# EAGLE design SOIL_WATER (EAGLE 9.6.2)
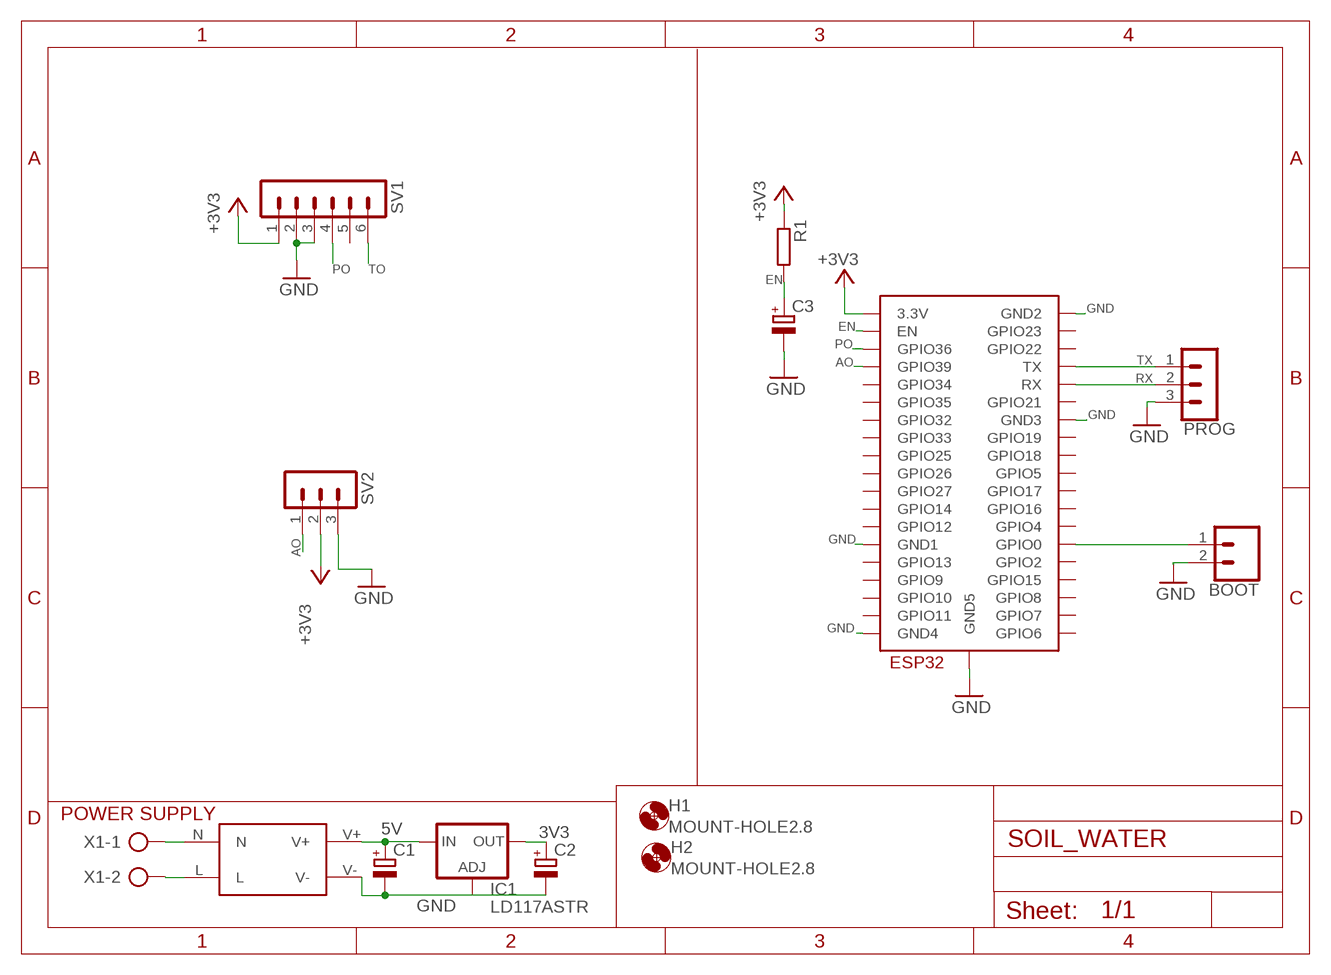
[diagram p0: schematic, sheet 1]

## Parts
BOOT  CONN_02  [1X02]
C1  CPOL-EUE1.8-4  [E1,8-4]
C2  CPOL-EUE1.8-4  [E1,8-4]
C3  CPOL-EUE1.8-4  [E1,8-4]
H1  MOUNT-HOLE2.8  [2,8]
H2  MOUNT-HOLE2.8  [2,8]
IC1  LD117ASTR  [SOT223]
PROG  MA03-1  [MA03-1]
R1  R-EU_0204/7  [0204/7]
SV1  MA06-1  [MA06-1]
SV2  MA03-1  [MA03-1]
U$1  ESP32-WROOM  [ESP32-WROOM]
U$2  HLK-PM01  [HLK-PM01-PAK]
X1  AK500/2  [AK500/2]

## Nets
3V3: C2.+ IC1.4(OUT)
5V: C1.+ IC1.3(IN) U$2.V+
+3V3: R1.1 SV1.1 SV2.2 U$1.3V3(3.3V)
AO: SV2.1 U$1.SENSOR_VN(GPIO39)
EN: C3.+ R1.2 U$1.EN
GND: BOOT.2 C1.- C2.- C3.- IC1.1(ADJ) PROG.3 SV1.2 SV1.3 SV2.3 U$1.GND1 U$1.GND2 U$1.GND3 U$1.GND4 U$1.GND5 U$2.V-
N$1: U$2.N X1.1
N$2: U$2.L X1.2
N$3: BOOT.1 U$1.IO0(GPIO0)
PO: SV1.4 U$1.SENSOR_VP(GPIO36)
RX: PROG.2 U$1.RX
TO: SV1.6
TX: PROG.1 U$1.TX
Unconnected: SV1.5 U$1.CLK(GPIO6) U$1.CMD(GPIO11) U$1.IO2(GPIO2) U$1.IO4(GPIO4) U$1.IO5(GPIO5) U$1.IO12(GPIO12) U$1.IO13(GPIO13) U$1.IO14(GPIO14) U$1.IO15(GPIO15) U$1.IO16(GPIO16) U$1.IO17(GPIO17) U$1.IO18(GPIO18) U$1.IO19(GPIO19) U$1.IO21(GPIO21) U$1.IO22(GPIO22) U$1.IO23(GPIO23) U$1.IO25(GPIO25) U$1.IO26(GPIO26) U$1.IO27(GPIO27) U$1.IO32(GPIO32) U$1.IO33(GPIO33) U$1.IO34(GPIO34) U$1.IO35(GPIO35) U$1.SD0(GPIO7) U$1.SD1(GPIO8) U$1.SD2(GPIO9) U$1.SD3(GPIO10)

## Notes on the sheet
- POWER SUPPLY

## Library data of the parts
BOOT = SparkFun-Connectors:CONN_02: Multi connection point. Often used as Generic Header-pin footprint for 0.1 inch spaced/style header connections On any of the 0.1 inch spaced packages, you can populate with these: Break Away Headers - Straight <https://www.sparkfun.com/products/116> (PRT-00116) Break Away Male Headers - Right Angle <https://www.sparkfun.com/products/553> (PRT-00553) Female Headers <https://www.sparkfun.com/products/115> (PRT-00115) Break Away Headers - Machine Pin <https://www.sparkfun.com/products/117> (PRT-00117) Break Away Female Headers - Swiss Machine Pin <https://www.sparkfun.com/products/743> (PRT-00743) For SCREWTERMINALS and SPRING TERMINALS visit here: Screw Terimnals on SparkFun.com <https://www.sparkfun.com/search/results?term=Screw+Terminals> (5mm/3.5mm/2.54mm spacing) This device is also useful as a general connection point to wire up your design to another part of your project. Our various solder wires solder well into these plated through hole pads. Hook-Up Wire - Assortment (Stranded, 22 AWG) <https://www.sparkfun.com/products/11375> (PRT-11375) Hook-Up Wire - Assortment (Solid Core, 22 AWG) <https://www.sparkfun.com/products/11367> (PRT-11367) View the entire wire category on our website here <https://www.sparkfun.com/categories/141> Special notes: Molex polarized connector foot print use with: PRT-08233 with associated crimp pins and housings. 2.54_SCREWTERM for use with PRT-10571. 3.5mm Screw Terminal footprints for PRT-08084 5mm Screw Terminal footprints for use with PRT-08432
C1-C3 = resistor:CPOL-EU: POLARIZED CAPACITOR, European symbol
H1 H2 = holes:MOUNT-HOLE: MOUNTING HOLE with drill center marker
IC1 = v-reg:LD117A?*: Low drop fixed and adjustable positive voltage regulators 1 A Source: http://www.st.com/stonline/products/literature/ds/7194/ld1117axx.pdf
PROG SV2 = con-lstb:MA03-1: PIN HEADER; OC_FARNELL: unknown; OC_NEWARK: unknown
R1 = resistor:R-EU_: RESISTOR, European symbol
SV1 = con-lstb:MA06-1: PIN HEADER; OC_FARNELL: unknown; OC_NEWARK: unknown
U$1 = ESP32:ESP32-WROOM
U$2 = HLK-PM01:HLK-PM01: Check prices <https://pricing.snapeda.com/parts/hlk-pm01/Hi-link/view-part?ref=eda>; AVAILABILITY: No availability data; DESCRIPTION: The 3W ultra-small series module power supply is a small-volume, high-efficiency AC DC power module supply designed by Shenzhen Hi-Link Electronics Co.,Ltd. It has the advantages of global input voltage range, low temperature rise, low power consumption,high efficiency, high reliability and high safety isolation. It has been widely used in smart home, automation control, communications equipment, instrumentation and other industries.; MF: Hi-link; MP: hlk-pm01; PACKAGE: Package; PRICE: None
X1 = con-ptr500:AK500/2: CONNECTOR; OC_FARNELL: unknown; OC_NEWARK: unknown

## Board
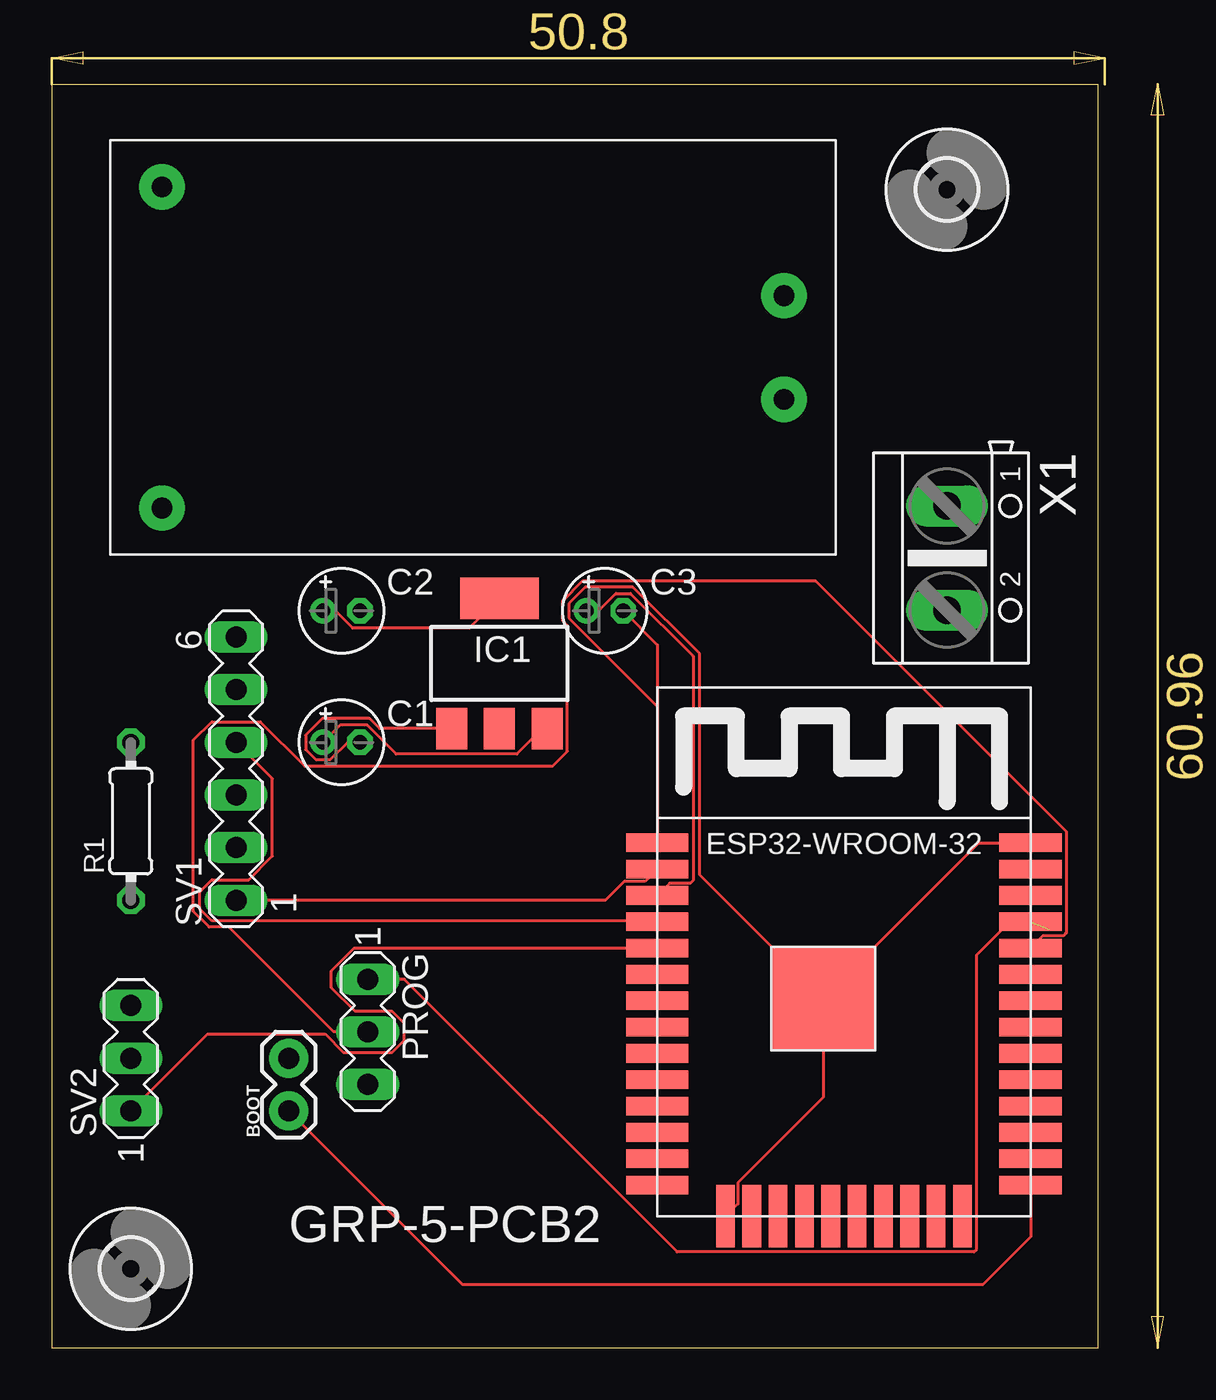
[diagram p1: board, top side]
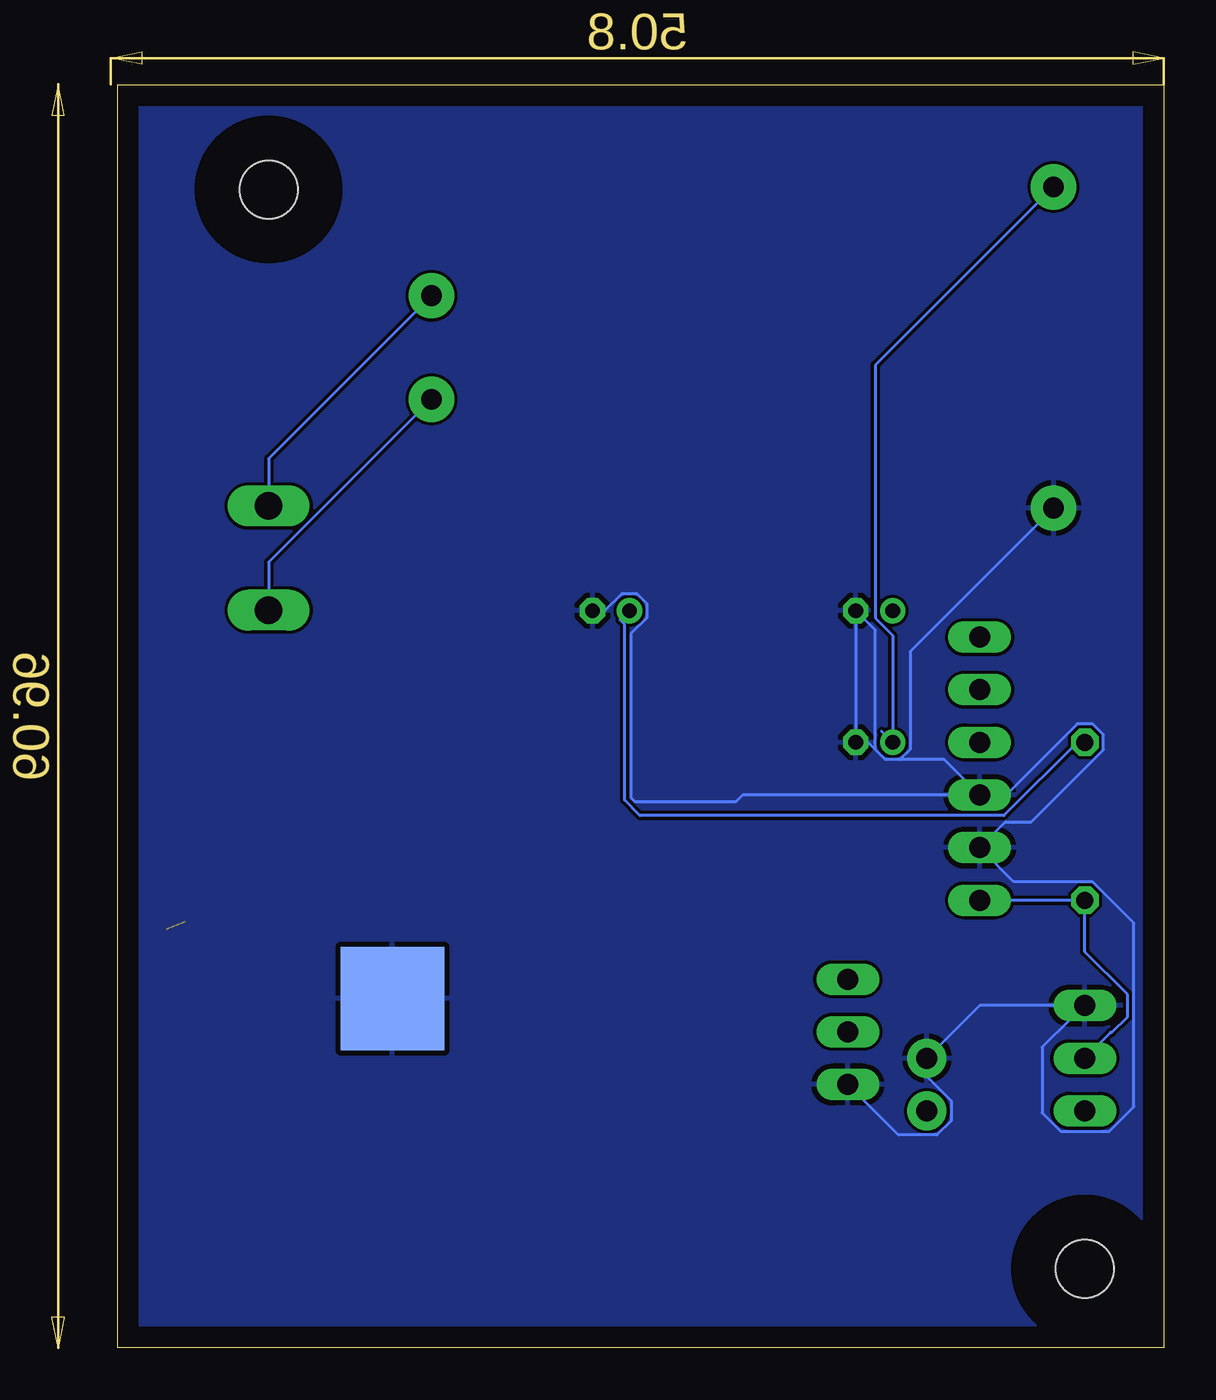
[diagram p2: board, bottom side, seen from below]

Size 50.47 x 60.95 mm. Coordinates in mm from the lower left corner, seen from the top.
Outline: 0,0 50.47,0 50.47,60.95 0,60.95 0,0
Copper layers (1*16): Top 0.035mm / dielectric 1.5mm / Bottom 0.035mm
Design rules "default": minimum track width 6mil, minimum drill 0.35mm, track to track 6mil, track to pad 6mil, pad to pad 6mil, via to via 6mil, smd to smd 6mil, copper to edge 40mil, drill to drill 6mil, minimum pad ring 10mil, minimum via ring 8mil, stop-mask expansion 4mil, vias tented up to drill 0mil, thermal gap 10mil

### Footprints (pad centres in the part's own frame; a part is rotated, then mirrored left to right if it is on the bottom)
1X02 = drill 1.016 pad 1.88: 1 0,0; 2 2.54,0
E1,8-4 = drill 0.711 pad 1.168: + -0.889,0 | drill 0.711 pad 1.168 octagon: - 0.889,0
2,8 = hole 2.8: 0,0
SOT223 = smd 1.5 x 2: 1 -2.3,-3.15; 2 0,-3.15; 3 2.3,-3.15 | smd 3.8 x 2: 4 0,3.15
MA03-1 = drill 1.016 long: 1 -2.54,0; 2 0,0; 3 2.54,0
0204/7 = drill 0.813 octagon: 1 -3.81,0; 2 3.81,0
MA06-1 = drill 1.016 long: 1 -6.35,0; 2 -3.81,0; 3 -1.27,0; 4 1.27,0; 5 3.81,0; 6 6.35,0
ESP32-WROOM = smd 3 x 0.9: 3V3 0,16.74; EN 0,15.47; GND1 0,18.01; GND3 18,18.01; IO0 18,1.5; IO4 18,2.77; IO5 18,6.58; IO12 0,1.5; IO14 0,2.77; IO16 18,4.04; IO17 18,5.31; IO18 18,7.85; IO19 18,9.12; IO21 18,11.66; IO22 18,15.47; IO23 18,16.74; IO25 0,6.58; IO26 0,5.31; IO27 0,4.04; IO32 0,9.12; IO33 0,7.85; IO34 0,11.66; IO35 0,10.39; NC 18,10.39; RX 18,12.93; SENSOR_VN 0,12.93; SENSOR_VP 0,14.2; TX 18,14.2 | smd 0.9 x 3: CLK 9.635,0; CMD 8.365,0; GND2 3.285,0; IO2 14.715,0; IO13 4.555,0; IO15 13.445,0; SD0 10.905,0; SD1 12.175,0; SD2 5.825,0; SD3 7.095,0 | smd 5 x 5: GND4 8,10.5 | smd 5 x 5 bottom: GND5 8,10.5
HLK-PM01-PAK = drill 1 pad 2.184: L -15,2.5; N -15,-2.5; V+ 15,-7.75; V- 15,7.75
AK500/2 = drill 1.321 long: 1 -2.515,0; 2 2.515,0

### Placement (x,y rotation side)
BOOT  11.43,11.43 90 top
C1  13.97,29.21 0 top
C2  13.97,35.56 0 top
C3  26.67,35.56 0 top
H1  43.18,55.88 0 top
H2  3.81,3.81 0 top
IC1  21.59,33.02 0 top
PROG  15.24,15.24 270 top
R1  3.81,25.4 90 top
SV1  8.89,27.94 90 top
SV2  3.81,13.97 90 top
U$1  29.21,6.35 0 top
U$2  20.32,48.26 180 top
X1  43.18,38.1 270 top

### Tracks (layer width: path | path; a pad name or v marks a point on that pad's centre or on a via)
3V3
  Top 0.152: C2.+ 13.67,35.56 14.51,34.72 20.14,34.72 IC1.4
5V
  Top 0.152: IC1.3 23.66,29.87 22.43,28.64 16.61,28.64 15.21,30.05 13.92,30.05 C1.+
  Bottom 0.152: U$2.V+ 13.92,47.41 13.92,35.21 13.08,34.38 C1.+ 13.61,29.74
+3V3
  Top 0.152: U$1.3V3 28.62,22.5 27.61,22.5 26.71,21.59 SV1.1
  Bottom 0.152: SV2.2 2.56,15.21 2.51,15.21 1.75,15.97 1.75,17.05 3.81,19.1 R1.1 SV1.1
AO
  Top 0.152: SV2.1 7.52,15.14 13.18,15.14 14.07,14.25 16.41,14.25 16.99,14.83 16.99,15.65 16.41,16.23 14.63,16.23 13.49,17.37 13.49,18.19 14.58,19.28 U$1.SENSOR_VN
EN
  Top 0.152: U$1.EN 29.8,22.41 30.8,22.41 30.94,22.55 30.94,33.37 27.91,36.4 27.21,36.4 26.37,35.56 C3.+
  Bottom 0.152: C3.+ 26.23,35.12 26.01,34.9 26.01,26.42 25.27,25.68 7.72,25.68 4.19,29.21 R1.2
GND
  Top 0.152: IC1.1 15.81,29.87 15.33,30.35 13.04,30.35 12.24,29.56 12.24,28.86 12.73,28.37 13.43,28.37 14.27,29.21 C1.- | U$1.GND3 44.72,24.36 38.12,17.76 38.12,16.53 38.1,16.51 37.76,16.85 U$1.GND4 | U$1.GND2 33.09,6.94 33.09,7.95 37.21,12.07 U$1.GND4 | C3.- 29.21,33.91 U$1.GND1 29.21,30.95 24.94,35.21 24.94,35.91 25.74,36.7 28.03,36.7 31.24,33.49 31.24,22.82 U$1.GND4
  Bottom 0.152: 12.73,28.37 12.24,28.86 12.24,33.59 U$2.V- | C2.- 13.92,34.62 13.92,28.86 | C2.- C1.- 14.27,29.21 | 14.27,29.21 14.86,29.8 C2.- | C3.- 26.97,35.56 26.13,36.4 25.43,36.4 24.94,35.91 24.94,35.21 25.7,34.45 25.7,26.54 25.53,26.36 20.62,26.36 20.32,26.67 SV1.3 | PROG.3 12.8,10.26 10.95,10.26 10.26,10.95 10.26,11.91 11.43,13.08 BOOT.2 8.89,16.51 SV2.3 4.5,15.82 4.55,15.82 5.87,14.51 5.87,11.32 4.98,10.44 2.64,10.44 1.45,11.63 1.45,20.48 3.44,22.48 7.24,22.48 SV1.2 7.64,25.38 6.39,25.38 2.92,28.84 2.92,29.58 3.44,30.1 4.18,30.1 7.61,26.67 SV1.3 | U$1.GND4 39.1,18.75 | 12.73,28.37 13.43,28.37 13.92,28.86 | 13.92,28.86 14.27,29.21 | SV1.3 10.59,28.37 12.73,28.37
  pour Bottom: 0,60.96 50.8,60.96 50.8,0 0,0
N$1
  Bottom 0.152: U$2.N 43.18,42.9 X1.1
N$2
  Bottom 0.152: U$2.L 40.97,40.11 | 40.97,40.11 | X1.2 43.18,37.9 40.97,40.11
N$3
  Top 0.152: U$1.IO0 47.21,5.35 44.91,3.05 19.81,3.05 BOOT.1
PO
  Top 0.152: U$1.SENSOR_VP 29.16,20.6 7.72,20.6 7.14,21.18 7.14,22 7.72,22.58 9.5,22.58 10.64,23.72 10.64,27.46 SV1.4
RX
  Top 0.152: PROG.2 13.59,15.24 8.54,20.3 7.59,20.3 6.83,21.05 6.83,29.32 7.72,30.2 10.06,30.2 12.2,28.07 24.16,28.07 24.87,28.77 24.87,34.86 24.64,35.09 24.64,36.03 25.61,37.01 36.84,37.01 48.94,24.91 48.94,20 48.8,19.87 47.8,19.87 U$1.RX
TX  (1 unrouted)
  Top 0.152: 48.12,20.18 48.26,20.32 | PROG.1 17.01,17.78 30.16,4.62 44.47,4.62 44.6,4.75 44.6,18.95 46.21,20.55 U$1.TX

### Text on the board
tPlace: GRP-5-PCB2